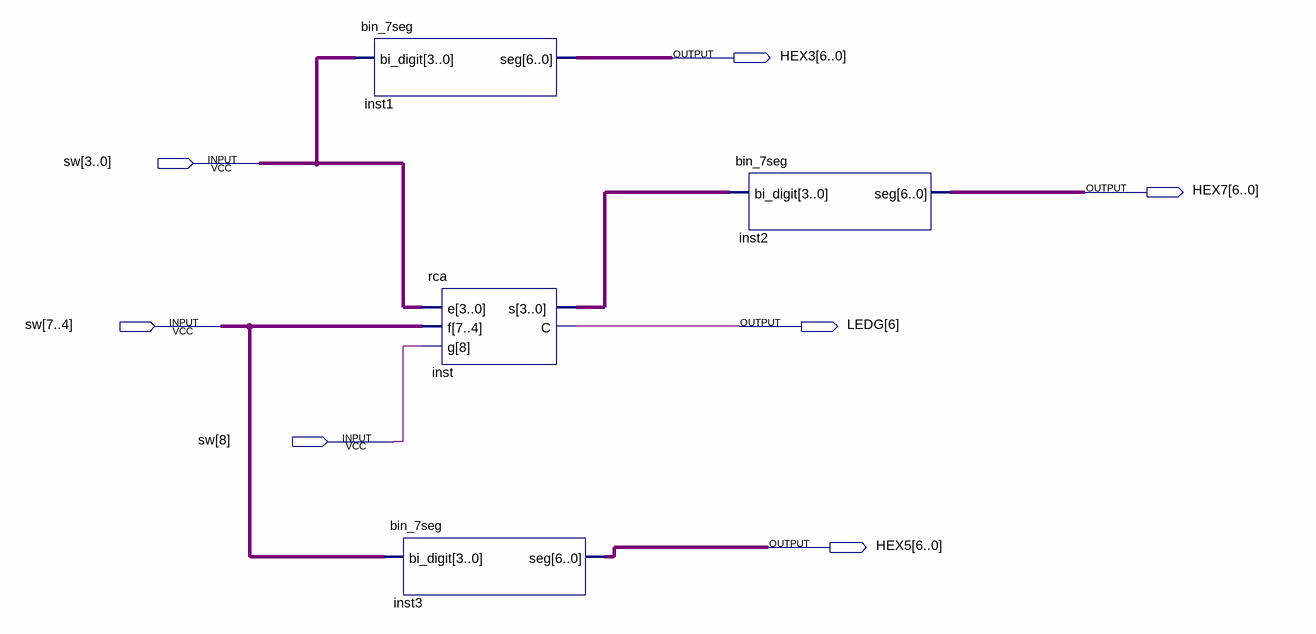
[diagram p0: schematic sheet]
// Quartus schematic lab5final.bdf as structural Verilog: 4 symbols, 7 pins
module lab5final (
  input  [8:0] sw,
  output [6:0] HEX3,
  output [6:0] HEX7,
  output [6:6] LEDG,
  output [6:0] HEX5
);

  wire [3:0] inst_s;

  bin_7seg inst1 (.bi_digit(sw[3:0]), .seg(HEX3));
  rca inst (.e(sw[3:0]), .f(sw[7:4]), .g(sw[8]), .s(inst_s), .C(LEDG[6]));
  bin_7seg inst3 (.bi_digit(sw[7:4]), .seg(HEX5));
  bin_7seg inst2 (.bi_digit(inst_s), .seg(HEX7));
endmodule
